# EAGLE design braeburn1 (EAGLE 6.1)
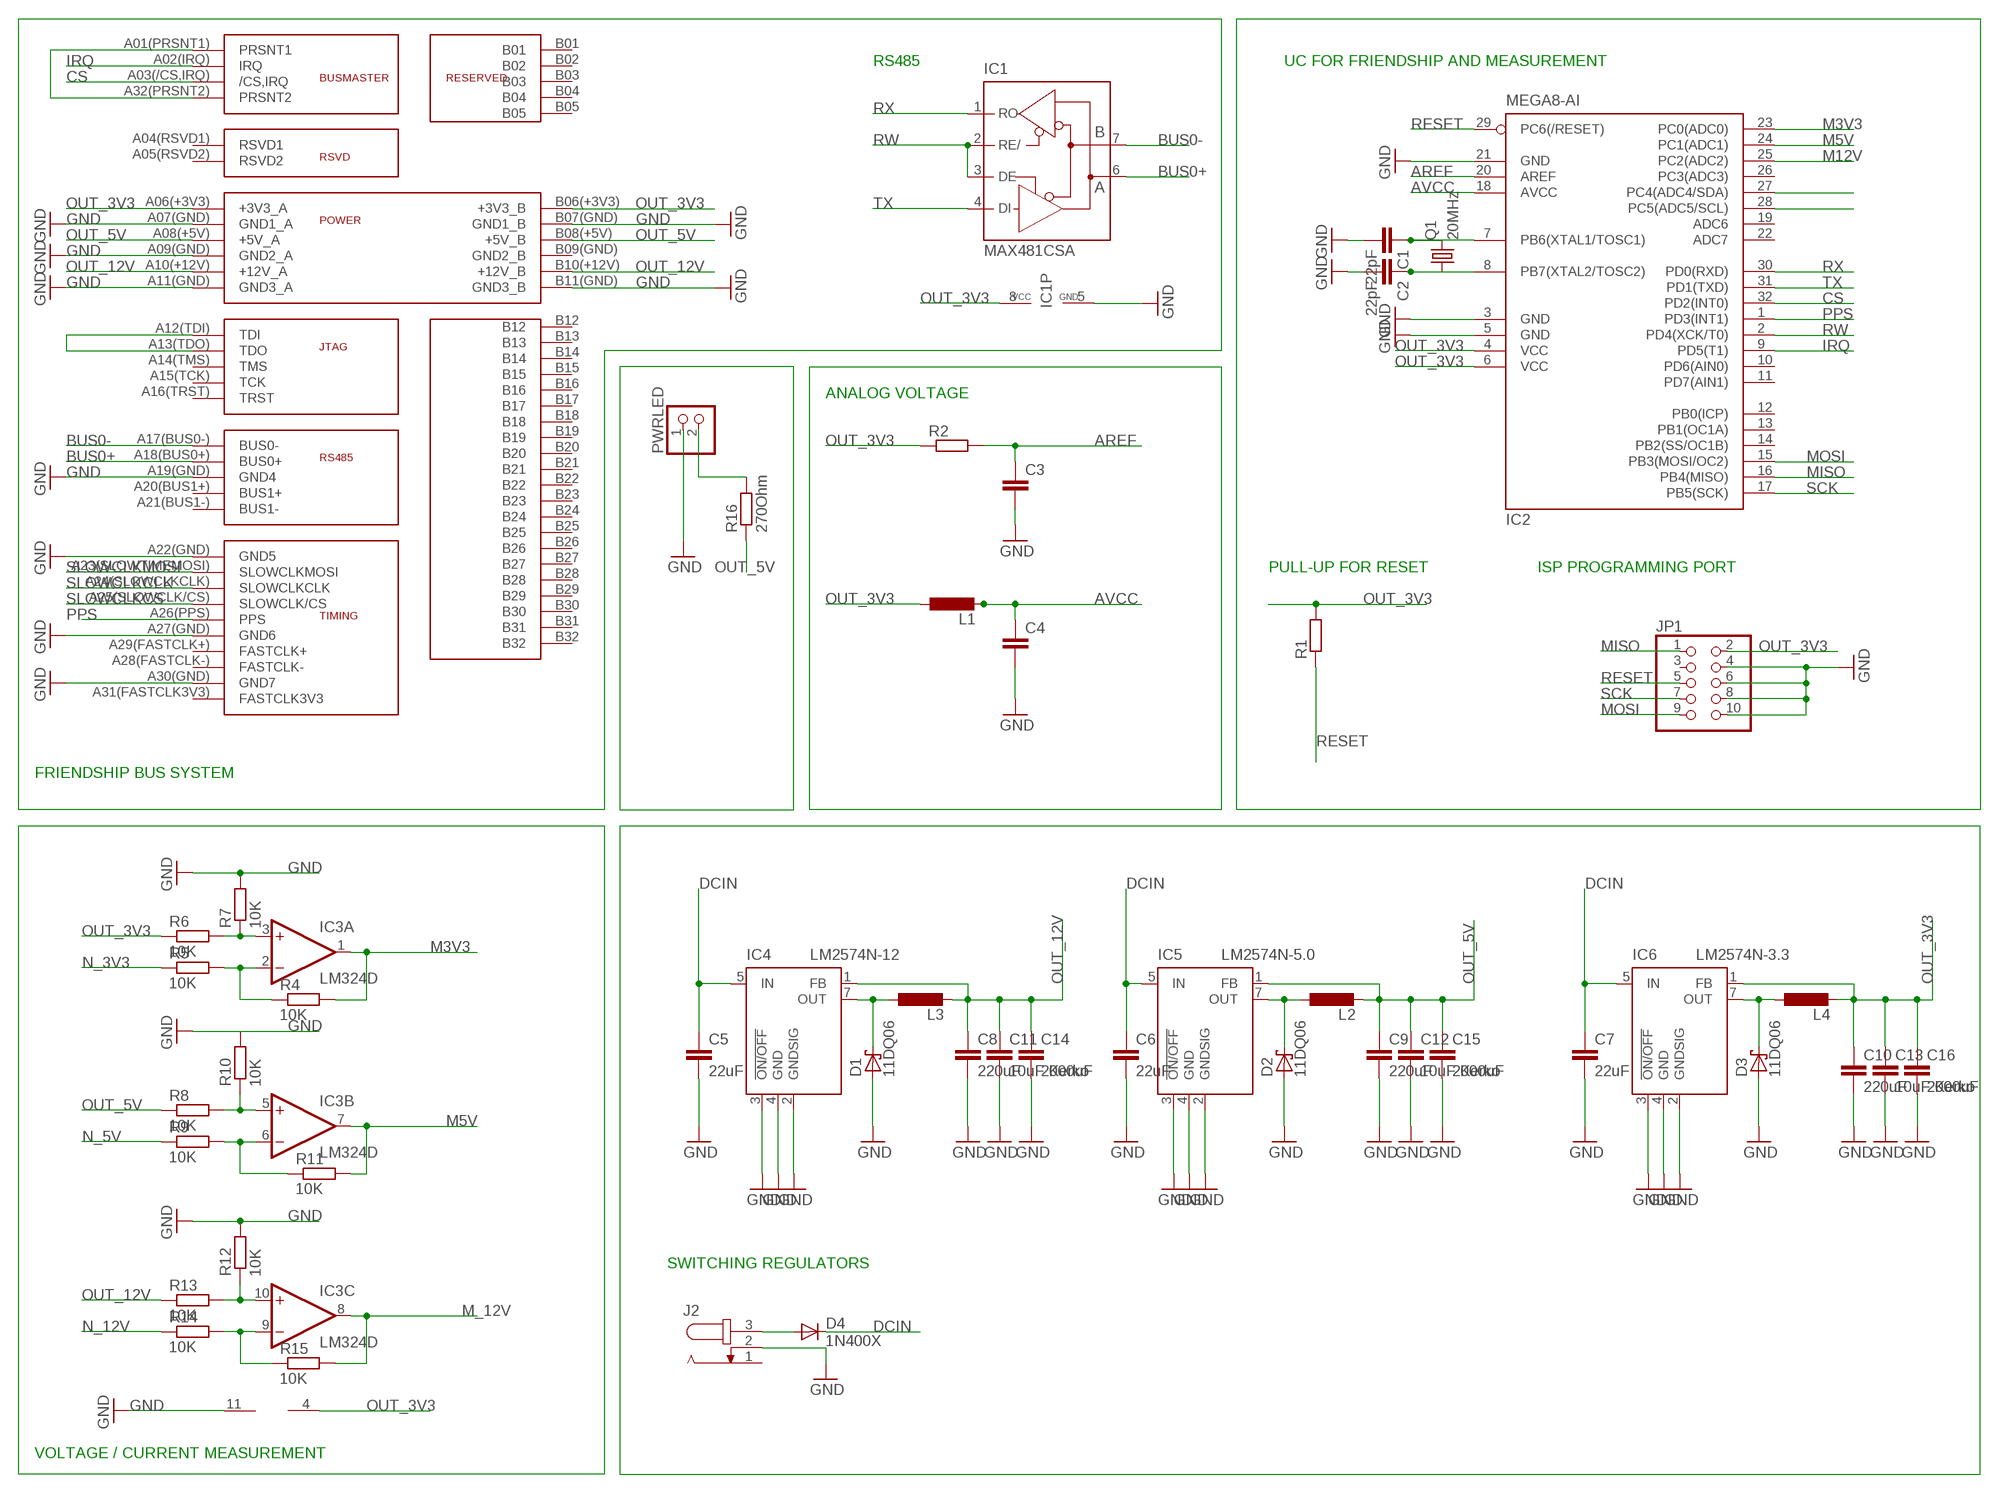
[diagram p0: schematic, sheet 1]

## Parts
C1  22pF  C-EUC0603  [C0603]
C2  22pF  C-EUC0603  [C0603]
C3  C-EUC0603  [C0603]
C4  C-EUC0603  [C0603]
C5  22uF  C-EU025-050X050  [C025-050X050]
C6  22uF  C-EU025-050X050  [C025-050X050]
C7  22uF  C-EU025-050X050  [C025-050X050]
C8  220uF  C-EU025-050X050  [C025-050X050]
C9  220uF  C-EU025-050X050  [C025-050X050]
C10  220uF  C-EU025-050X050  [C025-050X050]
C11  10uF Kerko  C-EUC0603  [C0603]
C12  10uF Kerko  C-EUC0603  [C0603]
C13  10uF Kerko  C-EUC0603  [C0603]
C14  2000uF  C-EU050-075X075  [C050-075X075]
C15  2000uF  C-EU050-075X075  [C050-075X075]
C16  2000uF  C-EU050-075X075  [C050-075X075]
D1  11DQ06  1N5817-B  [DO41-7.6]
D2  11DQ06  1N5817-B  [DO41-7.6]
D3  11DQ06  1N5817-B  [DO41-7.6]
D4  1N400X  1N4004  [DO41-10]
IC1  MAX481CSA  [SO08]
IC2  MEGA8-AI  [TQFP32-08]
IC3  LM324D  [SO14]
IC4  LM2574N-12  [DIL08]
IC5  LM2574N-5.0  [DIL08]
IC6  LM2574N-3.3  [DIL08]
J2  JACK-PLUG0  [SPC4077]
JP1  PINHD-2X5  [2X05]
L1  L-EU0207/5V  [0207/5V]
L2  L-EUPIS2816  [PIS2816]
L3  L-EUPIS2816  [PIS2816]
L4  L-EUPIS2816  [PIS2816]
PWRLED  PINHD-1X2  [1X02]
Q1  20MHz  CRYSTALHC33U-V  [HC33U-V]
R1  R-EU_R0603  [R0603]
R2  R-EU_R0603  [R0603]
R4  10K  R-EU_R0603  [R0603]
R5  10K  R-EU_R0603  [R0603]
R6  10K  R-EU_R0603  [R0603]
R7  10K  R-EU_R0603  [R0603]
R8  10K  R-EU_R0603  [R0603]
R9  10K  R-EU_R0603  [R0603]
R10  10K  R-EU_R0603  [R0603]
R11  10K  R-EU_R0603  [R0603]
R12  10K  R-EU_R0603  [R0603]
R13  10K  R-EU_R0603  [R0603]
R14  10K  R-EU_R0603  [R0603]
R15  10K  R-EU_R0603  [R0603]
R16  270Ohm  R-EU_R0603  [R0603]
U$1  FRIENDSHIPCONNECTOR  [FRIENDSHIP_EDGE_CONNECTOR]

## Nets
AREF: C3.1 IC2.20(AREF) R2.2
AVCC: C4.1 IC2.18(AVCC) L1.2
BUS0+: IC1.6(A) U$1.A18(BUS0+)(BUS0+)
BUS0-: IC1.7(B) U$1.A17(BUS0-)(BUS0-)
CS: IC2.32(PD2(INT0)) U$1.A03(/CS,IRQ)(/CS,IRQ)
DCIN: C5.1 C6.1 C7.1 D4.C IC4.5(IN) IC5.5(IN) IC6.5(IN)
GND: C1.2 C2.2 C3.2 C4.2 C5.2 C6.2 C7.2 C8.2 C9.2 C10.2 C11.2 C12.2 C13.2 C14.2 C15.2 C16.2 D1.A D2.A D3.A IC1.5(GND) IC2.3(GND) IC2.5(GND) IC2.21(GND) IC3.11(P:V-) IC4.2(GNDSIG) IC4.3(!ON/OFF) IC4.4(GND) IC5.2(GNDSIG) IC5.3(!ON/OFF) IC5.4(GND) IC6.2(GNDSIG) IC6.3(!ON/OFF) IC6.4(GND) J2.2 JP1.4 JP1.6 JP1.8 JP1.10 PWRLED.1 R7.2 R10.2 R12.2 U$1.A07(GND)(GND1_A) U$1.A09(GND)(GND2_A) U$1.A11(GND)(GND3_A) U$1.A19(GND)(GND4) U$1.A22(GND)(GND5) U$1.A30(GND)(GND7) U$1.B07(GND)(GND1_B) U$1.B11(GND)(GND3_B)
IRQ: IC2.9(PD5(T1)) U$1.A02(IRQ)(IRQ)
M3V3: IC2.23(PC0(ADC0)) IC3.1(A:OUT) R4.2
M5V: IC2.24(PC1(ADC1)) IC3.7(B:OUT) R11.2
M12V: IC2.25(PC2(ADC2))
M_12V: IC3.8(C:OUT) R15.2
MISO: IC2.16(PB4(MISO)) JP1.1
MOSI: IC2.15(PB3(MOSI/OC2)) JP1.9
N$1: U$1.A01(PRSNT1)(PRSNT1) U$1.A32(PRSNT2)(PRSNT2)
N$2: U$1.A12(TDI)(TDI) U$1.A13(TDO)(TDO)
N$4: C1.1 IC2.7(PB6(XTAL1/TOSC1)) Q1.2
N$5: C2.1 IC2.8(PB7(XTAL2/TOSC2)) Q1.1
N$7: IC3.2(A:-IN) R4.1 R5.2
N$8: IC3.3(A:+IN) R6.2 R7.1
N$11: IC2.27(PC4(ADC4/SDA))
N$12: IC2.28(PC5(ADC5/SCL))
N$14: IC3.6(B:-IN) R9.2 R11.1
N$15: D4.A J2.3
N$16: IC3.5(B:+IN) R8.2 R10.1
N$18: PWRLED.2 R16.2
N$20: IC3.10(C:+IN) R12.1 R13.2
N$21: IC3.9(C:-IN) R14.2 R15.1
N_3V3: D3.C IC6.7(OUT) L4.1 R5.1
N_5V: D2.C IC5.7(OUT) L2.1 R9.1
N_12V: D1.C IC4.7(OUT) L3.1 R14.1
OUT_3V3: C10.1 C13.1 C16.1 IC1.8(VCC) IC2.4(VCC) IC2.6(VCC) IC3.4(P:V+) IC6.1(FB) JP1.2 L1.1 L4.2 R1.2 R2.1 R6.1 U$1.A06(+3V3)(+3V3_A) U$1.B06(+3V3)(+3V3_B)
OUT_5V: C9.1 C12.1 C15.1 IC5.1(FB) L2.2 R8.1 R16.1 U$1.A08(+5V)(+5V_A) U$1.B08(+5V)(+5V_B)
OUT_12V: C8.1 C11.1 C14.1 IC4.1(FB) L3.2 R13.1 U$1.A10(+12V)(+12V_A) U$1.B10(+12V)(+12V_B)
PPS: IC2.1(PD3(INT1)) U$1.A26(PPS)(PPS)
RESET: IC2.29(PC6(/RESET)) JP1.5 R1.1
RW: IC1.2(RE/) IC1.3(DE) IC2.2(PD4(XCK/T0))
RX: IC1.1(RO) IC2.30(PD0(RXD))
SCK: IC2.17(PB5(SCK)) JP1.7
SLOWCLKCLK: U$1.A24(SLOWCLKCLK)(SLOWCLKCLK)
SLOWCLKCS: U$1.A25(SLOWCLK/CS)(SLOWCLK/CS)
SLOWCLKMOSI: U$1.A23(SLOWTIMEMOSI)(SLOWCLKMOSI)
TX: IC1.4(DI) IC2.31(PD1(TXD))
Unconnected: IC2.10(PD6(AIN0)) IC2.11(PD7(AIN1)) IC2.12(PB0(ICP)) IC2.13(PB1(OC1A)) IC2.14(PB2(SS/OC1B)) IC2.19(ADC6) IC2.22(ADC7) IC2.26(PC3(ADC3)) IC3.12(D:+IN) IC3.13(D:-IN) IC3.14(D:OUT) J2.1 JP1.3 U$1.A04(RSVD1)(RSVD1) U$1.A05(RSVD2)(RSVD2) U$1.A14(TMS)(TMS) U$1.A15(TCK)(TCK) U$1.A16(TRST)(TRST) U$1.A20(BUS1+)(BUS1+) U$1.A21(BUS1-)(BUS1-) U$1.A27(GND)(GND6) U$1.A28(FASTCLK-)(FASTCLK-) U$1.A29(FASTCLK+)(FASTCLK+) U$1.A31(FASTCLK3V3)(FASTCLK3V3) U$1.B01 U$1.B02 U$1.B03 U$1.B04 U$1.B05 U$1.B09(GND)(GND2_B) U$1.B12 U$1.B13 U$1.B14 U$1.B15 U$1.B16 U$1.B17 U$1.B18 U$1.B19 U$1.B20 U$1.B21 U$1.B22 U$1.B23 U$1.B24 U$1.B25 U$1.B26 U$1.B27 U$1.B28 U$1.B29 U$1.B30 U$1.B31 U$1.B32

## Notes on the sheet
- RS485 | UC FOR FRIENDSHIP AND MEASUREMENT
- ANALOG VOLTAGE
- PULL-UP FOR RESET | ISP PROGRAMMING PORT
- FRIENDSHIP BUS SYSTEM
- SWITCHING REGULATORS
- VOLTAGE / CURRENT MEASUREMENT

## Library data of the parts
C1-C16 = rcl:C-EU: CAPACITOR, European symbol
D1-D3 = diode:1N581*: 1.0A SCHOTTKY BARRIER RECTIFIER Source: http://www.diodes.com/datasheets/ds23001.pdf
D4 = diode:1N4004: DIODE general purpose rectifier, 1 A
IC1 = maxim:MAX481CSA: RS485 TRANSEIVER; MF: MAXIM; MPN: MAX481CSA; OC_FARNELL: unknown; OC_NEWARK: 90C3817
IC2 = atmel:MEGA8: MICROCONTROLLER 8 Kbytes FLASH, 1 kbytes SRAM, 512 bytes EEPROM, USART, 6-channel 10 bit ADC, 2-channel 8 bit ADC Pin compatible with Atmega48, ATMega88, ATMega168 Source: avr.lbr; MPN: ATMEGA8-16AU; OC_FARNELL: 9171371; OC_NEWARK: 73M8863
IC3 = linear:LM324: OP AMP
IC4-IC6 = linear:LM2574?-*: SIMPLE SWITCHER 0.5A Step-Down Voltage Regulator Source: http://cache.national.com/ds/LM/LM2574.pdf
J2 = con-jack:JACK-PLUG: DC POWER JACK Power Jack, DC, Right Angle, Through Hole, Rated 5A at 16VDC, PC Terminals Distributor: Farnell (www.Farnell.de) Drawing: 84N1161.pdf / 84N1162.pdf Manufacturer: SPC Technology (www.spctechnology.com) Type: SPC4077 / SPC 4078; OC_FARNELL: unknown; OC_NEWARK: unknown
JP1 = pinhead:PINHD-2X5: PIN HEADER
L1-L4 = rcl:L-EU: INDUCTOR, European symbol
PWRLED = pinhead:PINHD-1X2: PIN HEADER
Q1 = crystal:CRYSTAL: CRYSTAL; OC_FARNELL: unknown; OC_NEWARK: unknown
R1 R2 R4-R16 = rcl:R-EU_: RESISTOR, European symbol
U$1 = hgg:FRIENDSHIP

## Board
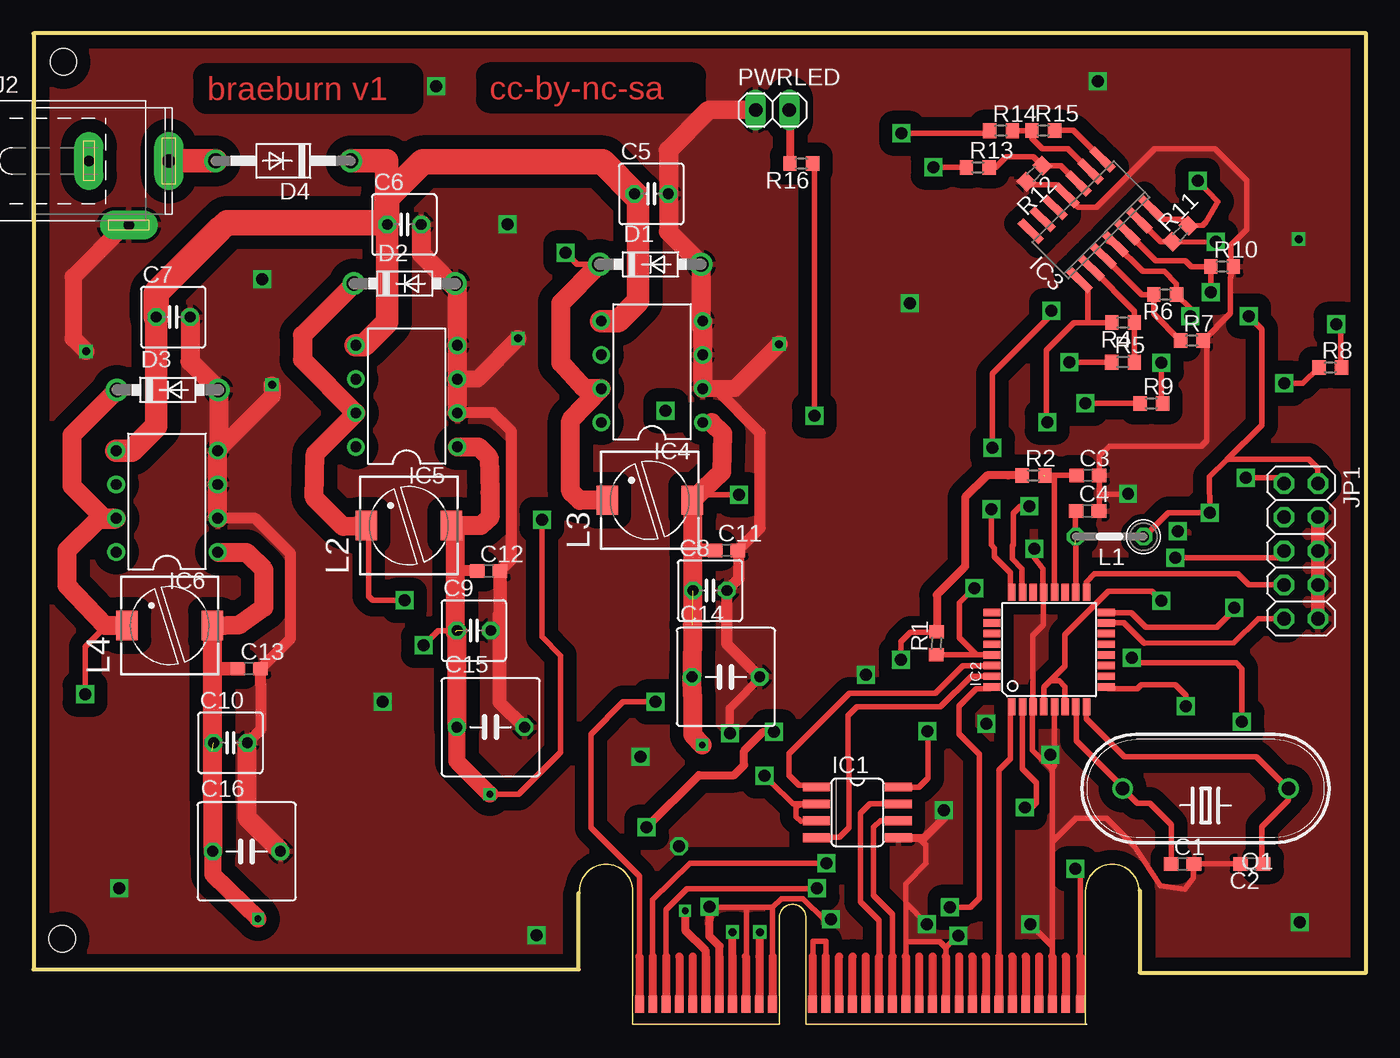
[diagram p1: board, top side]
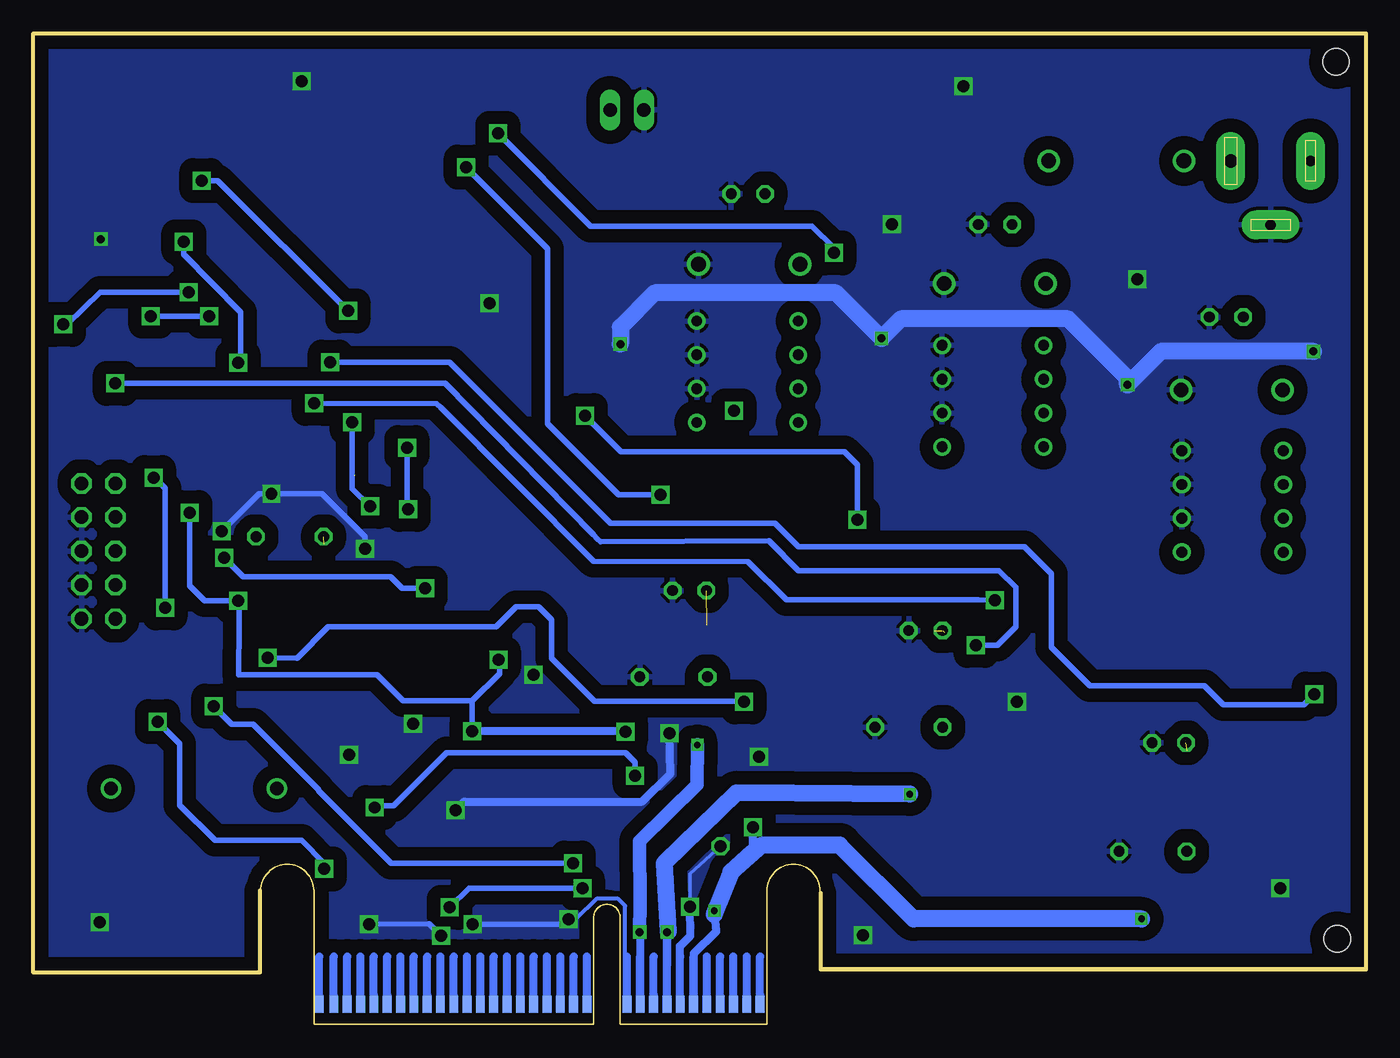
[diagram p2: board, bottom side, seen from below]

Size 100.06 x 74.37 mm. Coordinates in mm from the lower left corner, seen from the top.
Outline: 83.06,10.04 83.06,3.86 100.06,3.86 100.06,74.37 0.01,74.37 0.01,4.11 40.94,4.11 40.94,9.86
Copper layers (1*16): Top 0.035mm / dielectric 1.5mm / Bottom 0.035mm
Design rules: minimum track width 10mil, minimum drill 24mil, track to track 8mil, track to pad 8mil, pad to pad 8mil, via to via 8mil, smd to smd 8mil, copper to edge 40mil, drill to drill 8mil, minimum pad ring 10mil, minimum via ring 8mil, stop-mask expansion 4mil, vias tented up to drill 0mil, thermal gap 10mil
Holes 2 mm at 2.17,6.41 2.27,72.22

### Footprints (pad centres in the part's own frame; a part is rotated, then mirrored left to right if it is on the bottom)
C0603 = smd 1.1 x 1: 1 -0.85,0; 2 0.85,0
C025-050X050 = drill 0.813 octagon: 1 -1.27,0; 2 1.27,0
C050-075X075 = drill 0.813 octagon: 1 -2.54,0; 2 2.54,0
DO41-7.6 = drill 1.1 pad 1.7: A 3.81,0; C -3.81,0
DO41-10 = drill 1.118: A 5.08,0; C -5.08,0
SO08 = smd 0.66 x 2.032: 1 -1.905,-3.073; 2 -0.635,-3.073; 3 0.635,-3.073; 4 1.905,-3.073; 5 1.905,3.073; 6 0.635,3.073; 7 -0.635,3.073; 8 -1.905,3.073
TQFP32-08 = smd 1.27 x 0.559: 1 -4.293,2.8; 2 -4.293,2; 3 -4.293,1.2; 4 -4.293,0.4; 5 -4.293,-0.4; 6 -4.293,-1.2; 7 -4.293,-2; 8 -4.293,-2.8; 17 4.293,-2.8; 18 4.293,-2; 19 4.293,-1.2; 20 4.293,-0.4; 21 4.293,0.4; 22 4.293,1.2; 23 4.293,2; 24 4.293,2.8 | smd 0.559 x 1.27: 9 -2.8,-4.293; 10 -2,-4.293; 11 -1.2,-4.293; 12 -0.4,-4.293; 13 0.4,-4.293; 14 1.2,-4.293; 15 2,-4.293; 16 2.8,-4.293; 25 2.8,4.293; 26 2,4.293; 27 1.2,4.293; 28 0.4,4.293; 29 -0.4,4.293; 30 -1.2,4.293; 31 -2,4.293; 32 -2.8,4.293
SO14 = smd 0.6 x 2.2: 1 -3.81,-2.6; 2 -2.54,-2.6; 3 -1.27,-2.6; 4 0,-2.6; 5 1.27,-2.6; 6 2.54,-2.6; 7 3.81,-2.6; 8 3.81,2.6; 9 2.54,2.6; 10 1.27,2.6; 11 0,2.6; 12 -1.27,2.6; 13 -2.54,2.6; 14 -3.81,2.6
DIL08 = drill 0.813 pad 1.27: 1 -3.81,-3.81; 2 -1.27,-3.81; 3 1.27,-3.81; 4 3.81,-3.81; 5 3.81,3.81; 6 1.27,3.81; 7 -1.27,3.81; 8 -3.81,3.81
SPC4077 = drill 0.8 pad 2.184 long: 1 -3,0; 2 0,-4.8 | drill 1 pad 2.184 long: 3 3,0
2X05 = drill 1.016 octagon: 1 -5.08,-1.27; 2 -5.08,1.27; 3 -2.54,-1.27; 4 -2.54,1.27; 5 0,-1.27; 6 0,1.27; 7 2.54,-1.27; 8 2.54,1.27; 9 5.08,-1.27; 10 5.08,1.27
0207/5V = drill 0.813 octagon: 1 -2.54,0; 2 2.54,0
PIS2816 = smd 2.2 x 1.6: 1 0,3.2; 2 0,-3.2
1X02 = drill 1.016 long: 1 -1.27,0; 2 1.27,0
HC33U-V = drill 1.016: 1 -6.223,0; 2 6.223,0
R0603 = smd 1 x 1.1: 1 -0.85,0; 2 0.85,0
FRIENDSHIP_EDGE_CONNECTOR = smd 0.66 x 1.27: A01(PRSNT1) 45.5,-14.5; A02(IRQ) 46.5,-14.5; A03(/CS,IRQ) 47.5,-14.5; A04(RSVD1) 48.5,-14.5; A05(RSVD2) 49.5,-14.5; A06(+3V3) 50.5,-14.5; A07(GND) 51.5,-14.5; A08(+5V) 52.5,-14.5; A09(GND) 53.5,-14.5; A10(+12V) 54.5,-14.5; A11(GND) 55.5,-14.5; A12(TDI) 58.5,-14.5; A13(TDO) 59.5,-14.5; A14(TMS) 60.5,-14.5; A15(TCK) 61.5,-14.5; A16(TRST) 62.5,-14.5; A17(BUS0-) 63.5,-14.5; A18(BUS0+) 64.5,-14.5; A19(GND) 65.5,-14.5; A20(BUS1+) 66.5,-14.5; A21(BUS1-) 67.5,-14.5; A22(GND) 68.5,-14.5; A23(SLOWTIMEMOSI) 69.5,-14.5; A24(SLOWCLKCLK) 70.5,-14.5; A25(SLOWCLK/CS) 71.5,-14.5; A26(PPS) 72.5,-14.5; A27(GND) 73.5,-14.5; A28(FASTCLK-) 74.5,-14.5; A29(FASTCLK+) 75.5,-14.5; A30(GND) 76.5,-14.5; A31(FASTCLK3V3) 77.5,-14.5; A32(PRSNT2) 78.6,-14.5 | smd 0.66 x 1.27 bottom: B01 45.5,-14.5; B02 46.5,-14.5; B03 47.5,-14.5; B04 48.5,-14.5; B05 49.5,-14.5; B06(+3V3) 50.5,-14.5; B07(GND) 51.5,-14.5; B08(+5V) 52.5,-14.5; B09(GND) 53.5,-14.5; B10(+12V) 54.5,-14.5; B11(GND) 55.5,-14.5; B12 58.5,-14.5; B13 59.5,-14.5; B14 60.5,-14.5; B15 61.5,-14.5; B16 62.5,-14.5; B17 63.5,-14.5; B18 64.5,-14.5; B19 65.5,-14.5; B20 66.5,-14.5; B21 67.5,-14.5; B22 68.5,-14.5; B23 69.5,-14.5; B24 70.5,-14.5; B25 71.5,-14.5; B26 72.5,-14.5; B27 73.5,-14.5; B28 74.5,-14.5; B29 75.5,-14.5; B30 76.5,-14.5; B31 77.5,-14.5; B32 78.6,-14.5

### Placement (x,y rotation side)
C1  86.27,12.03 0 top
C2  91.47,12.03 180 top
C3  79.17,41.19 0 top
C4  79.14,38.52 0 top
C5  46.4,62.32 0 top
C6  27.85,60.02 0 top
C7  10.5,53.07 0 top
C8  50.8,32.55 0 top
C9  33.07,29.54 0 top
C10  14.8,21.12 0 top
C11  52.04,35.56 0 top
C12  34.18,34.01 0 top
C13  16.2,26.68 0 top
C14  51.99,26.06 0 top
C15  34.33,22.29 0 top
C16  16.02,12.97 0 top
D1  46.32,57.03 0 top
D2  27.89,55.58 0 top
D3  10.1,47.6 0 top
D4  18.77,64.79 180 top
IC1  61.86,15.89 270 top
IC2  76.26,28.11 90 top
IC3  79.41,60.37 45 top
IC4  46.45,48.96 90 top
IC5  28.03,47.14 90 top
IC6  10.04,39.24 90 top
J2  7.17,64.79 0 top
JP1  95.17,35.51 270 top
L1  80.8,36.59 180 top
L2  28.2,37.42 90 top
L3  46.28,39.32 90 top
L4  10.24,29.92 90 top
PWRLED  55.49,68.61 0 top
Q1  88,17.69 180 top
R1  67.8,28.59 88.9 top
R2  75.09,41.19 0 top
R4  81.81,52.66 180 top
R5  81.8,49.69 0 top
R6  84.97,54.76 180 top
R7  86.97,51.31 0 top
R8  97.36,49.28 0 top
R9  83.94,46.59 0 top
R10  89.25,56.85 0 top
R11  86.11,59.33 45 top
R12  75.16,63.83 225 top
R13  70.91,64.31 0 top
R14  72.65,67.06 0 top
R15  75.82,67.08 0 top
R16  330Ohm  [R0603]  57.66,64.59 180 top
U$1  0,16 0 top

### Tracks (layer width: path | path; a pad name or v marks a point on that pad's centre or on a via)
AREF  (1 unrouted)
  Top 0.406: IC2.20 76.66,37.82 76.64,37.84 76.64,41.19 76.61,41.16 76.06,41.16 | 75.89,41.16 76.06,41.16 | 76.06,41.16 76.09,41.19 C3.1
AVCC  (1 unrouted)
  Top 0.406: IC2.18 78.26,36.03 | 78.26,36.03 78.27,36.04 | 78.26,36.03 78.22,36.03 78.22,38.52 C4.1
BUS0+
  Top 0.406: U$1.A18(BUS0+) 64.5,8.25 63.09,9.66 63.09,14.76 63.59,15.26 IC1.6
BUS0-
  Top 0.406: IC1.7 64.92,16.54 62.81,16.54 62.09,15.81 62.09,9.19 63.5,7.8 U$1.A17(BUS0-)
CS  (via drill 0.9)
  Top 0.406: U$1.A03(/CS,IRQ) 47.5,8.6 49.06,10.16 58.79,10.16 v58.84,10.21 | v68.81,8.76 70.36,8.76 71.04,9.44 71.04,20.27 69.49,21.81 69.49,23.86 70.79,25.16 71.82,25.16 IC2.32
  Bottom 0.406: v58.84,10.21 67.36,10.21 v68.81,8.76
DCIN
  Top 1.27: IC4.5 42.67,52.74 43.77,52.74 45.34,54.31 45.34,62.12 | 26.54,62.04 26.54,61.64 | 26.54,60.06 C6.1
  Top 1.422: 45.39,62.06 C5.1
  Top 1.676: IC4.5 43.9,52.77 45.39,54.27 45.39,62.06 | IC6.5 7.4,43.05 9.23,44.88 C7.1 | C6.1 26.58,52.68 24.85,50.95 IC5.5
  Top 1.778: 14.62,60.16 14.54,60.16 | D4.C 26.54,64.79 26.54,61.64
  Top 1.93: C7.1 9.23,54.91 14.04,59.71 14.54,60.16 | 45.34,62.12 42.74,64.72 29.21,64.72 26.54,62.04 | 26.54,60.06 26.54,60.14 | 26.54,61.64 26.54,60.14 | 26.54,60.14 14.62,60.16
GND  (via drill 0.6, 0.9)
  Top 0.406: C4.2 80.02,38.55 80.02,39.79 | 80.02,39.79 C3.2 80.02,42.65 80.77,43.39 87.69,43.39 88.09,43.79 88.09,51.04 R7.2 89.87,53.36 89.86,53.37 89.86,56.02 R10.2 89.89,56.05 89.89,58.46 91.09,59.66 91.09,61.71 91.09,63.31 88.69,65.72 84.22,65.72 79.81,61.31 78.47,61.31 IC3.11 76.79,62.99 74.8,62.99 R12.2 | U$1.A19(GND) 65.5,6.19 | 65.5,6.19 65.5,9.11 | 65.5,9.11 65.5,10.55 67.02,12.06 67.02,13.44 66.49,13.96 IC1.5 | 76.5,13.69 U$1.A30(GND) 76.5,5.85 v74.86,7.51 | 76.5,13.69 76.5,19.08 76.41,19.16 | 76.41,19.16 75.02,20.56 75.02,23.78 IC2.3 75.06,29.21 75.84,29.99 75.84,32.39 IC2.21 75.79,32.48 75.79,34.19 75.14,35.02 v75.14,35.66 | IC2.5 76.66,19.41 76.41,19.16 | C2.2 C1.2 87.11,10.98 86.44,10.14 84.61,10.39 83.34,12.34 82.66,13.34 80.56,15.44 78.25,15.44 76.5,13.69 | U$1.A22(GND) 68.5,5.75 | 68.5,5.75 68.06,6.19 65.5,6.19 | v69.47,6.64 68.88,6.14 68.5,5.75 | v82.19,39.81 82.16,39.79 80.02,39.79 | JP1.4 96.27,38.05 | 55.56,1.58 U$1.B11(GND) 55.5,8.76 | v67.09,7.49 65.5,9.11 | U$1.A09(GND) 53.52,1.51 53.54,8.76 | v50.77,8.81 50.81,8.76 53.54,8.76 | 53.54,8.76 55.5,8.76 | 55.5,8.76 56.15,9.41 57.79,9.41 59.34,7.86 v59.89,7.86
  Top 0.61: IC1.5 66.91,13.99 68.36,15.44 v68.36,16.06 | v52.29,21.84 52.29,23.71 54.79,26.24 54.79,26.36 | U$1.B07(GND) 51.52,1.51 51.52,5.86 50.74,6.64 v50.77,8.81
  Top 0.813: C10.2 17.09,22.14 17.09,25.46 17.05,25.5 C13.2 19.32,28.95 19.32,35.31 16.66,37.97 IC6.2 | IC4.2 51.23,47.7 54.56,44.37 54.56,37.23 C11.2 52.99,35.66 52.99,33.46 C8.2 52.07,28.52 C14.2 | C12.2 35.89,34.87 35.89,44.49 34.49,45.89 31.96,45.89 | 31.96,45.89 31.74,45.89 31.82,45.96 31.82,46.04 31.96,46.04 31.96,45.89 | 31.96,45.89 31.74,46.12 31.74,48.71 31.84,48.62 IC5.3 | C9.2 34.87,29.54 35.02,29.69 35.02,27.82 35.01,27.81
  Top 1.016: JP1.4 JP1.6 JP1.8 JP1.10 | C15.2 34.99,24.14 35.01,27.81 C12.2
  Top 1.27: J2.2 6.92,59.99 2.99,56.06 2.99,51.46 v3.96,50.49 | v17.92,47.99 17.92,47.12 IC6.4 | v36.39,51.46 33.34,48.41 IC5.3 | v55.99,51.04 52.64,47.7 IC4.2
  Top 1.422: IC5.2 IC5.3 IC5.4 31.84,55.09 | IC6.2 IC6.3 IC6.4 13.91,43.12 D3.A 11.77,49.74 C7.2 | IC4.4 50.25,52.21 | 50.25,52.21 IC4.3 IC4.2 | 50.25,52.21 50.13,52.34 D1.A 47.67,59.49 C5.2 47.67,65.59 50.66,68.59 PWRLED.1 | 31.84,55.09 31.84,55.44 D2.A | C6.2 29.12,57.8 31.84,55.09 | C16.2 16.07,15.45 C10.2
  Bottom 0.254: v50.77,8.81 50.77,11.29 v48.46,13.36
  Bottom 0.305: U$1.B11(GND) 55.63,1.63 55.63,8.88 56.17,9.41 57.79,9.41 59.34,7.86 v59.89,7.86
  Bottom 0.406: v74.86,7.51 70.36,7.54 v69.47,6.64 | v75.14,35.66 75.14,36.59 78.36,39.81 v82.19,39.81 83.11,39.81 v85.94,36.99 | v59.89,7.86 60.27,7.49 v67.09,7.49
  Bottom 0.61: v68.36,16.06 67.72,16.71 54.36,16.71 52.24,18.79 v52.29,21.84 | U$1.B07(GND) 51.52,1.51 51.52,5.86 50.74,6.64 v50.77,8.81
  Bottom 1.27: v3.96,50.49 15.41,50.49 v17.92,47.99 17.92,48.46 22.39,52.94 34.91,52.94 v36.39,51.46 39.81,54.89 53.41,54.89 55.99,52.31 v55.99,51.04
  other vias: 30.24,70.39 79.91,70.76 95.09,7.64 26.21,24.19 6.44,10.19 37.77,6.69 17.17,55.91 35.59,60.04 65.81,54.12 45.59,20.09 71.56,22.54 76.36,20.24 62.52,26.21 94.99,58.91
  pour Bottom (isolate 1.016): -0.14,74.39 99.81,74.39 99.99,3.91 83.09,3.91 83.09,10.19 arc90 81.22,12.06 81.04,12.06 arc90 78.94,9.96 78.94,0.09 57.94,0.09 57.94,8.19 arc90 57.21,8.91 56.86,8.91 arc90 56.02,8.06 56.02,0.11 44.96,0.11 44.96,10.24 45.02,10.24 arc90 43.27,11.99 42.74,11.99 arc90 40.94,10.19 40.94,4.16 -0.06,4.16 -0.06,74.26 0.07,74.26
  pour Top (isolate 1.016): -0.04,74.49 99.94,74.49 99.99,3.94 83.04,3.94 83.04,10.06 arc90 81.22,11.89 80.79,11.89 arc90 78.99,10.09 78.99,0.11 58.04,0.11 58.04,8.14 58.06,8.14 arc90 57.27,8.94 56.81,8.94 arc90 56.04,8.16 56.04,0.04 44.94,0.04 44.94,10.21 44.99,10.21 arc90 43.24,11.96 42.74,11.96 arc90 40.94,10.16 40.94,4.16 -0.04,4.16 -0.04,74.24 0.01,74.24
IRQ  (via drill 0.9)
  Top 0.406: U$1.A02(IRQ) 46.5,9.32 49.29,12.09 v59.54,12.09 | v86.52,23.86 86.52,24.69 85.74,25.46 83.19,25.46 82.89,25.16 80.7,25.16 IC2.9
  Bottom 0.406: v59.54,12.09 73.22,12.06 78.64,17.52 78.64,17.59 83.56,22.52 85.16,22.52 v86.52,23.86
M3V3  (via drill 0.9)
  Top 0.406: IC2.23 74.22,32.45 74.22,34.19 73.49,34.91 73.49,35.91 73.56,35.99 73.56,38.34 74.09,38.87 v74.79,38.87 | v76.11,45.19 76.06,45.24 76.06,50.59 78.13,52.66 79.16,52.66 | 79.16,52.66 R4.2 | IC3.1 79.16,55.23 79.16,52.66
  Bottom 0.406: v74.79,38.87 76.11,40.19 v76.11,45.19
M5V  (via drill 0.9)
  Top 0.406: IC2.24 73.34,32.53 73.34,33.89 72.16,35.06 72.16,35.71 71.91,35.96 v71.91,38.64 | v87.41,63.31 88.91,61.71 88.04,60.19 87.8,59.95 R11.2 86.23,60.41 84.75,60.41 IC3.7 | v72.02,43.27 72.02,48.81 76.44,53.24 v76.44,53.54
  Bottom 0.406: 86.49,63.29 86.64,63.29 | 86.64,63.29 v87.41,63.31 | v71.91,38.64 72.02,38.74 v72.02,43.27 | v76.44,53.54 86.22,63.31 86.64,63.31 86.64,63.29
M_12V
  Top 0.406: 76.91,67.08 R15.2 78.09,67.08 IC3.8
MISO  (via drill 0.9)
  Top 0.406: IC2.16 80.58,30.89 82.44,30.89 83.54,29.79 88.84,29.79 90.16,31.11 v90.16,31.24 | v91.04,41.02 93.47,41.02 JP1.1
  Bottom 0.406: v90.16,31.24 90.16,40.24 90.94,41.02 v91.04,41.02
MOSI
  Top 0.406: JP1.9 91.95,30.43 90.14,28.64 83.41,28.59 81.86,30.14 80.58,30.14 IC2.15
N$1  (via drill 0.9)
  Top 0.406: U$1.A01(PRSNT1) 45.52,1.51 45.52,11.09 41.86,14.74 41.86,21.77 44.29,24.19 v46.71,24.19 | v82.47,27.49 82.84,27.11 90.31,27.11 90.74,26.69 v90.74,22.71 | v78.22,11.66 78.6,11.28 U$1.A32(PRSNT2)
  Bottom 0.406: v46.71,24.19 46.77,24.24 57.91,24.24 61.14,27.46 61.14,30.34 62.14,31.34 63.81,31.34 65.31,29.84 77.94,29.84 80.27,27.46 v82.47,27.49 | v90.74,22.71 89.06,21.04 89.06,16.44 86.41,13.79 79.91,13.79 78.22,12.09 v78.22,11.66
N$2
  Top 0.406: U$1.A12(TDI) 58.52,1.51 58.52,6.21 59.49,6.21 59.49,1.31 59.5,1.31 U$1.A13(TDO)
N$3  (via drill 0.9)
  other vias: 47.46,46.04
N$4
  Top 0.406: IC2.7 78.29,23.79 78.29,21.29 81.78,17.8 Q1.2 82.88,16.59 83.81,16.59 85.42,14.98 C1.1
N$5
  Top 0.406: IC2.8 79.06,22.92 81.89,20.09 91.83,20.09 Q1.1 94.23,16.8 92.24,14.81 92.24,12.11 C2.1
N$7
  Top 0.406: R5.2 82.66,52.64 R4.1 82.66,53.52 IC3.2
N$8
  Top 0.406: R7.1 84.12,53.3 R6.2 83.22,54.76 IC3.3
N$14  (via drill 0.9)
  Top 0.406: R9.2 84.69,46.68 v84.69,49.64 | v88.77,58.71 88.19,58.7 R11.1 84.64,58.73 IC3.6
  Bottom 0.406: v84.69,49.64 84.52,49.81 84.52,53.44 88.77,57.79 v88.77,58.71
N$15
  Top 1.778: J2.3 D4.A
N$16  (via drill 0.9)
  Top 0.406: v88.39,54.94 88.39,55.81 R10.1 86.95,56.85 86.49,57.31 84.26,57.31 IC3.5 | v97.81,52.52 98.16,52.16 98.16,49.23 | R8.2 98.16,49.23 | 98.16,49.23 98.16,49.14
  Bottom 0.406: v88.39,54.94 95.04,54.94 97.52,52.52 v97.81,52.52
N$18
  Top 0.61: PWRLED.2 56.81,68.39 R16.2
N$20
  Top 0.406: 75.95,64.48 R12.1 | R12.1 75.1,65.09 73.06,65.09 72.28,64.31 R13.2 | IC3.10 77.14,64.43 R12.1
N$21
  Top 0.406: 75.13,67.08 R15.1 | R15.1 74.94,67.06 R14.2 | IC3.9 77.68,65.69 75.77,65.69 74.97,66.48 R15.1
N_3V3  (via drill 0.9)
  Top 0.406: D3.C 2.67,43.98 2.67,43.79 3.17,43.29 3.17,39.87 5.09,37.94 5.09,37.84 2.27,35.02 2.27,32.81 5.29,29.79 5.29,29.71 3.89,28.31 v3.89,24.77 | v77.77,49.69 78.06,49.69 R5.1
  Top 1.016: 6.17,37.91 IC6.7
  Top 1.422: L4.1 5.39,29.92 2.54,32.91 2.54,35.59 4.87,37.91 6.17,37.91 | IC6.7 5.33,37.97 2.92,40.39 2.92,44.23 D3.C
  Bottom 0.406: v3.89,24.77 4.69,23.96 10.71,23.96 12.14,25.39 20.74,25.39 23.64,28.29 23.64,33.81 25.67,35.84 42.61,35.84 44.39,37.62 56.71,37.62 68.81,49.69 v77.77,49.69
N_5V  (via drill 0.9)
  Top 0.406: L2.1 25.17,37.25 25.17,32.12 25.46,31.81 v27.87,31.81 | v78.97,46.59 79.14,46.59 R9.1
  Top 1.422: L2.1 23.26,37.34 21.09,39.52 21.17,42.82 IC5.7 20.21,49.87 20.21,51.71 D2.C
  Bottom 0.406: v27.87,31.81 29.17,31.84 43.52,31.84 46.41,34.71 57.99,34.74 69.49,46.31 69.79,46.56 v78.97,46.59
N_12V  (via drill 0.9)
  Top 0.406: R14.1 71.61,66.87 v65.19,66.87 | v39.96,57.89 40.82,57.03 D1.C
  Top 1.422: L3.1 41.03,39.32 40.34,39.96 40.34,45.32 IC4.7 41.38,47.7 39.61,49.64 39.61,54.11 D1.C
  Bottom 0.406: v65.19,66.87 58.21,59.89 41.59,59.89 39.96,58.27 v39.96,57.89
OUT_3V3  (via drill 0.5, 0.9)  (1 unrouted)
  Top 0.406: IC1.8 66.5,17.8 67.16,18.46 67.16,21.94 v67.11,21.99 | v65.14,27.36 65.14,28.69 65.86,29.41 67.8,29.41 R1.2 | IC2.6 77.46,25.32 77.02,25.77 76.36,25.77 75.86,25.27 IC2.4 75.86,25.29 77.44,26.86 77.44,29.24 80.69,32.49 83.97,32.49 v84.69,31.77 | L1.1 83.37,36.54 85.22,38.39 v88.31,38.39 88.29,41.09 89.6,42.38 | JP1.2 96.41,41.71 95.74,42.39 89.66,42.39 | 80.67,58.77 IC3.4 83.29,56.49 84.91,56.49 85.83,55.58 R6.1 86.89,53.69 v86.86,53.14 | v91.24,53.14 92.24,52.14 92.24,44.96 89.6,42.38 | 89.66,42.39 89.69,42.41 89.69,42.44 89.74,42.44 | 89.66,42.39 89.65,42.38 89.6,42.38
  Top 0.61: R2.1 73.19,41.19 71.61,41.19 69.94,39.54 69.94,34.34 67.82,32.22 R1.2 | v46.04,14.76 49.96,18.69 52.61,18.69 53.36,19.44 53.36,20.52 54.79,21.94 v55.61,21.94 | U$1.B06(+3V3) 50.5,5.5 48.94,7.06 v48.94,8.51
  Top 1.016: 13.88,35.39 IC6.1 | C13.1 13.65,26.68 13.44,26.89
  Top 1.27: C16.1 13.47,11.23 v16.87,7.91
  Top 1.422: 13.88,35.39 16.02,35.39 17.32,34.09 17.32,31.29 15.49,29.99 L4.2 13.44,26.89 13.44,20.53 C16.1
  Bottom 0.406: v67.11,21.99 67.11,24.27 | 67.11,24.27 65.06,26.31 65.06,27.29 v65.14,27.36 | v88.31,38.39 88.31,32.89 87.19,31.77 v84.69,31.77 84.61,31.69 84.61,30.04 84.64,26.21 74.24,26.21 72.29,24.27 67.11,24.27 | v86.86,53.14 v91.24,53.14
  Bottom 0.61: 46.09,12.86 46.04,13.54 v46.04,14.76 | v55.61,21.94 55.66,21.99 v67.11,21.99 | v48.94,8.51 48.95,7.96 48.95,8.25 | 48.97,8.23 48.94,8.43 v48.94,8.51 | U$1.B06(+3V3) 50.47,1.53 50.47,5.32 48.79,6.97 v48.94,8.51
  Bottom 1.27: v16.87,7.91 33.99,7.91 39.54,13.44 45.41,13.41 47.69,11.41 | 47.69,11.41 48.95,8.25 | 46.09,12.86 47.69,11.41
OUT_5V  (via drill 0.5, 0.6, 0.9)  (2 unrouted)
  Top 0.406: R8.1 95.32,48.09 v93.91,48.09 | v29.29,28.44 30.39,29.54 32.41,29.54 | R16.1 58.64,64.38 v58.64,45.66 | v38.19,37.87 38.19,29.06 39.59,27.66 39.59,20.41 36.44,17.27 v34.27,17.27
  Top 0.61: U$1.B08(+5V) 52.49,1.51 v52.49,6.91
  Top 0.813: C12.1 33.29,34.04 31.67,34.04
  Top 1.27: C15.1 31.79,19.74 v34.27,17.27
  Top 1.422: IC5.1 33.42,43.33 34.21,42.54 34.29,39.91 34.29,38.04 33.59,37.41 | 33.59,37.41 L2.2 | 33.59,37.41 31.29,37.41 31.67,37.04 31.67,34.04 31.67,29.41 | C9.1 31.79,29.53 C15.1
  Bottom 0.406: v93.91,48.09 69.14,48.09 57.99,36.74 57.74,36.44 57.46,36.21 44.84,36.27 42.61,34.04 28.46,34.04 28.44,34.02 27.59,34.02 26.32,32.79 26.32,29.81 27.69,28.44 v29.29,28.44 | v58.64,45.66 55.94,42.96 39.16,42.96 38.19,41.99 v38.19,37.87
  Bottom 0.61: 52.41,6.96 52.45,7.25 U$1.B08(+5V) 52.5,1.52 52.52,1.54 | v52.49,6.91 52.52,6.74 52.52,1.54 | 52.52,1.44 52.52,1.54
  Bottom 1.27: v34.27,17.27 47.29,17.36 52.71,12.06 52.41,6.96
OUT_12V  (via drill 0.5, 0.6, 0.9)  (1 unrouted)
  Top 0.406: R13.1 v67.56,64.31 | v52.96,39.74 50.27,39.74 50.33,40.14
  Top 0.61: v54.54,6.91 54.5,7.05 U$1.B10(+12V)
  Top 1.016: IC4.1 50.92,45.16 | C11.1 49.6,35.56 49.48,35.44
  Top 1.422: 50.92,45.16 51.74,44.34 51.66,41.43 50.33,40.14 L3.2 49.48,35.44 49.48,29.96 C14.1 49.5,24.63 49.5,21.73 v50.21,20.96
  Bottom 0.406: v67.56,64.31 61.44,58.19 61.44,45.06 56.11,39.74 v52.96,39.74
  Bottom 0.61: 54.52,9.06 54.49,6.61 | U$1.B10(+12V) 54.49,1.51 54.49,6.61 | 54.49,6.61 54.54,6.66 v54.54,6.91
  Bottom 1.016: v50.21,20.96 50.24,17.99 54.54,13.74 54.52,9.06 v54.54,6.91 54.54,6.86
PPS
  Top 0.406: U$1.A26(PPS) 72.5,19.07 73.36,19.94 73.36,23.73 IC2.1
RESET  (via drill 0.9)
  Top 0.406: R1.1 71.94,27.74 IC2.29 70.81,27.71 69.54,28.99 69.54,31.64 v70.64,32.71 | v85.74,35.02 93.48,35.02 JP1.5
  Bottom 0.406: v70.64,32.71 72.39,32.71 73.24,33.56 84.31,33.59 v85.74,35.02
RW  (via drill 0.9)
  Top 0.406: IC1.3 57.61,15.21 57.27,15.56 57.27,16.24 57.52,16.49 57.74,16.49 57.75,16.5 IC1.2 57.02,16.53 55.41,18.14 55.39,18.14 v54.89,18.64 | v74.44,16.27 74.91,16.27 75.29,16.64 75.29,18.11 74.24,19.16 74.24,23.8 IC2.2
  Bottom 0.406: v54.89,18.64 54.89,19.66 55.61,20.39 69.04,20.39 73.02,16.41 74.29,16.41 v74.44,16.27
RX
  Top 0.406: IC1.1 58.65,17.94 57.49,17.94 56.74,18.69 56.74,20.31 61.27,24.84 67.72,24.84 69.79,26.91 IC2.30
SCK
  Top 0.406: IC2.17 79.06,33.19 79.66,33.79 90.44,33.79 91.27,32.96 JP1.7
TX
  Top 0.406: IC1.4 58.84,14.04 60.52,14.04 61.21,14.74 61.21,19.96 61.16,20.02 61.16,23.16 61.81,23.81 68.11,23.81 70.41,26.11 IC2.31

### Text on the board
Top: braeburn v1 | cc-by-nc-sa